# Altium schematic sheet rev02_16.SchDoc
size 282 x 200 mm
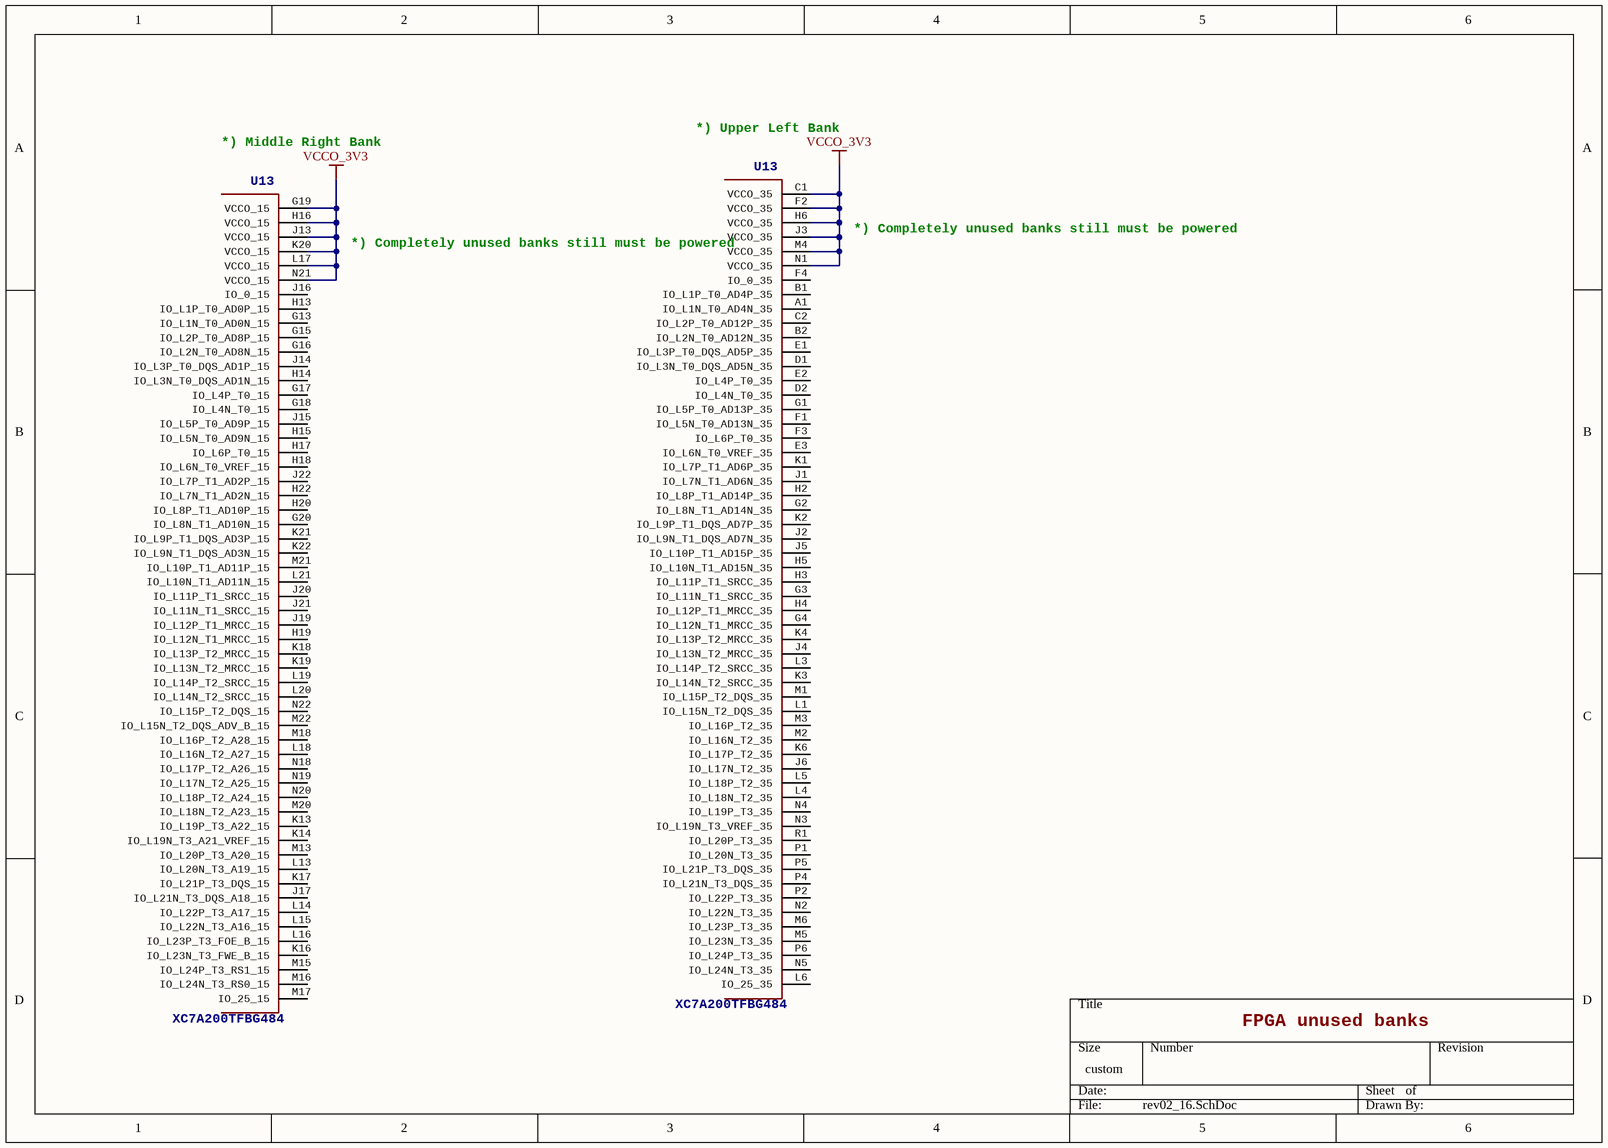
[diagram p0: rev02_16.SchDoc]

## Parts
U13  >NAME: U13  [BGA484C100P22X22_2300X2300X254]  (hidden comment: XC7A200TFBG484)  (parts D,G of 17)

## Nets
VCCO_3V3: U13.C1(VCCO_35) U13.F2(VCCO_35) U13.G19(VCCO_15) U13.H6(VCCO_35) U13.H16(VCCO_15) U13.J3(VCCO_35) U13.J13(VCCO_15) U13.K20(VCCO_15) U13.L17(VCCO_15) U13.M4(VCCO_35) U13.N1(VCCO_35) U13.N21(VCCO_15)

Not connected (* = marked no-connect by the designer): U13 A1(IO_L1N_T0_AD4N_35) B1(IO_L1P_T0_AD4P_35) B2(IO_L2N_T0_AD12N_35) C2(IO_L2P_T0_AD12P_35) D1(IO_L3N_T0_DQS_AD5N_35) D2(IO_L4N_T0_35) E1(IO_L3P_T0_DQS_AD5P_35) E2(IO_L4P_T0_35) E3(IO_L6N_T0_VREF_35) F1(IO_L5N_T0_AD13N_35) F3(IO_L6P_T0_35) F4(IO_0_35) G1(IO_L5P_T0_AD13P_35) G2(IO_L8N_T1_AD14N_35) G3(IO_L11N_T1_SRCC_35) G4(IO_L12N_T1_MRCC_35) G13(IO_L1N_T0_AD0N_15) G15(IO_L2P_T0_AD8P_15) G16(IO_L2N_T0_AD8N_15) G17(IO_L4P_T0_15) G18(IO_L4N_T0_15) G20(IO_L8N_T1_AD10N_15) H2(IO_L8P_T1_AD14P_35) H3(IO_L11P_T1_SRCC_35) H4(IO_L12P_T1_MRCC_35) H5(IO_L10N_T1_AD15N_35) H13(IO_L1P_T0_AD0P_15) H14(IO_L3N_T0_DQS_AD1N_15) H15(IO_L5N_T0_AD9N_15) H17(IO_L6P_T0_15) H18(IO_L6N_T0_VREF_15) H19(IO_L12N_T1_MRCC_15) H20(IO_L8P_T1_AD10P_15) H22(IO_L7N_T1_AD2N_15) J1(IO_L7N_T1_AD6N_35) J2(IO_L9N_T1_DQS_AD7N_35) J4(IO_L13N_T2_MRCC_35) J5(IO_L10P_T1_AD15P_35) J6(IO_L17N_T2_35) J14(IO_L3P_T0_DQS_AD1P_15) J15(IO_L5P_T0_AD9P_15) J16(IO_0_15) J17(IO_L21N_T3_DQS_A18_15) J19(IO_L12P_T1_MRCC_15) J20(IO_L11P_T1_SRCC_15) J21(IO_L11N_T1_SRCC_15) J22(IO_L7P_T1_AD2P_15) K1(IO_L7P_T1_AD6P_35) K2(IO_L9P_T1_DQS_AD7P_35) K3(IO_L14N_T2_SRCC_35) K4(IO_L13P_T2_MRCC_35) K6(IO_L17P_T2_35) K13(IO_L19P_T3_A22_15) K14(IO_L19N_T3_A21_VREF_15) K16(IO_L23N_T3_FWE_B_15) K17(IO_L21P_T3_DQS_15) K18(IO_L13P_T2_MRCC_15) K19(IO_L13N_T2_MRCC_15) K21(IO_L9P_T1_DQS_AD3P_15) K22(IO_L9N_T1_DQS_AD3N_15) L1(IO_L15N_T2_DQS_35) L3(IO_L14P_T2_SRCC_35) L4(IO_L18N_T2_35) L5(IO_L18P_T2_35) L6(IO_25_35) L13(IO_L20N_T3_A19_15) L14(IO_L22P_T3_A17_15) L15(IO_L22N_T3_A16_15) L16(IO_L23P_T3_FOE_B_15) L18(IO_L16N_T2_A27_15) L19(IO_L14P_T2_SRCC_15) L20(IO_L14N_T2_SRCC_15) L21(IO_L10N_T1_AD11N_15) M1(IO_L15P_T2_DQS_35) M2(IO_L16N_T2_35) M3(IO_L16P_T2_35) M5(IO_L23N_T3_35) M6(IO_L23P_T3_35) M13(IO_L20P_T3_A20_15) M15(IO_L24P_T3_RS1_15) M16(IO_L24N_T3_RS0_15) M17(IO_25_15) M18(IO_L16P_T2_A28_15) M20(IO_L18N_T2_A23_15) M21(IO_L10P_T1_AD11P_15) M22(IO_L15N_T2_DQS_ADV_B_15) N2(IO_L22N_T3_35) N3(IO_L19N_T3_VREF_35) N4(IO_L19P_T3_35) N5(IO_L24N_T3_35) N18(IO_L17P_T2_A26_15) N19(IO_L17N_T2_A25_15) N20(IO_L18P_T2_A24_15) N22(IO_L15P_T2_DQS_15) P1(IO_L20N_T3_35) P2(IO_L22P_T3_35) P4(IO_L21N_T3_DQS_35) P5(IO_L21P_T3_DQS_35) P6(IO_L24P_T3_35) R1(IO_L20P_T3_35)

## Notes on the sheet
- *) Middle Right Bank
- *) Upper Left Bank
- *) Completely unused banks
  still must be powered
- FPGA unused banks

## Library data of the parts
U13 = XC7A200TFBG484: Xilinx FPGA: XC7A200TFBG484; MPN: XC7A200T-1FBG484C; MFR: Xilinx; OC_DIGIKEY: 122-1871-ND; >VALUE: XC7A200TFBG484